# Altium schematic sheet Power_Scheme.SchDoc
size 209 x 297 mm; Author: ALTIUM GOSTBOM2.0 KEV; SheetNumber: 3; SheetTotal: 3
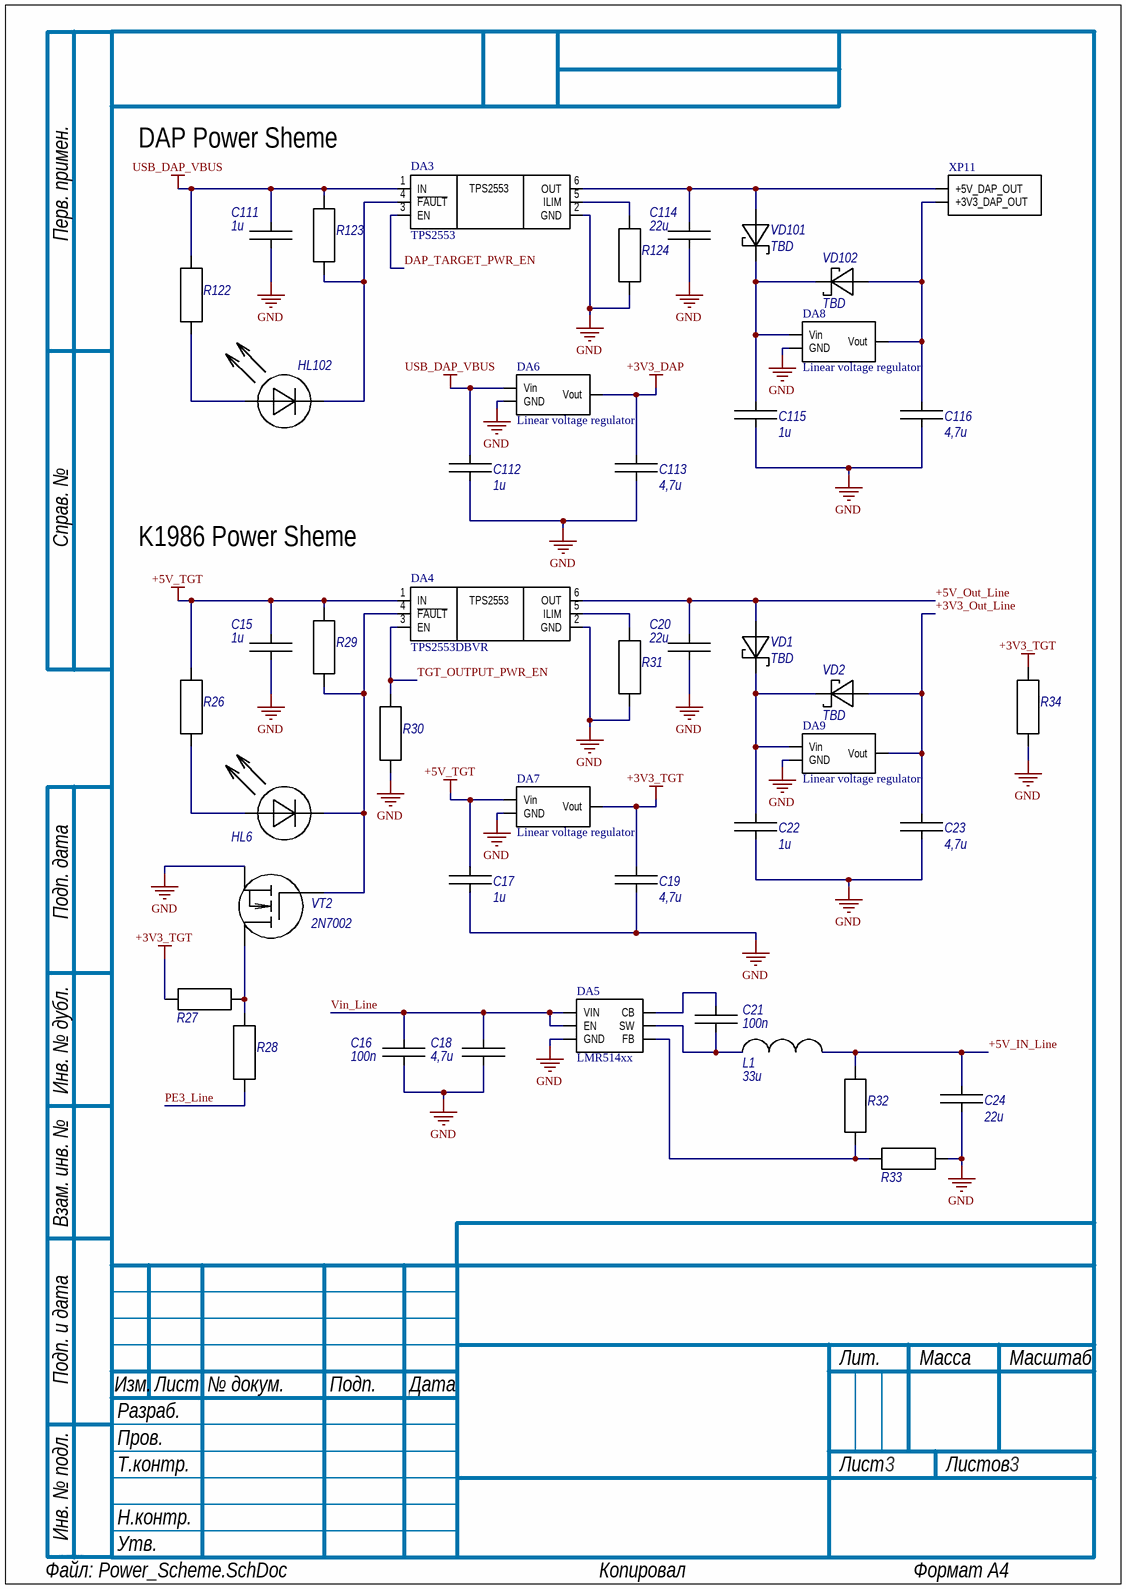
[diagram p0: Power_Scheme.SchDoc]

## Parts
C15  1u
C16  100n
C17  1u
C18  4,7u
C19  4,7u
C20  22u
C21  100n
C22  1u
C23  4,7u
C24  22u
C111  1u
C112  1u
C113  4,7u
C114  22u
C115  1u
C116  4,7u
DA3  TPS2553
DA4  TPS2553DBVR
DA5  LMR514xx
DA6  Linear voltage regulator
DA7  Linear voltage regulator
DA8  Linear voltage regulator
DA9  Linear voltage regulator
HL6  TBD  (value not drawn)
HL102  TBD  (value not drawn)
L1  33u
R26  TBD  (value not drawn)
R27  10k  (value not drawn)
R28  1k  (value not drawn)
R29  100k  (value not drawn)
R30  10k  (value not drawn)
R31  100k  (value not drawn)
R32  118k  (value not drawn)
R33  22,1k  (value not drawn)
R34  TBD  (value not drawn)
R122  TBD  (value not drawn)
R123  100k  (value not drawn)
R124  100k  (value not drawn)
VD1  TBD
VD2  TBD
VD101  TBD
VD102  TBD
VT2  2N7002
XP11  DAP_External_Power_Outputs  (value not drawn)

## Nets
+3V3_DAP: C113.1 DA6.2(Vout)
+3V3_TGT: C19.1 DA7.2(Vout) R27.2 R34.1
+5V_TGT: C15.1 C17.1 DA4.1(IN) DA7.3(Vin) R26.2 R29.1
GND: C15.2 C16.2 C17.2 C18.2 C19.2 C20.2 C22.2 C23.2 C24.2 C111.2 C112.2 C113.2 C114.2 C115.2 C116.2 DA3.2(GND) DA4.2(GND) DA5.2(GND) DA6.1(GND) DA7.1(GND) DA8.1(GND) DA9.1(GND) R30.2 R31.2 R33.1 R34.2 R124.2 VT2.S
USB_DAP_VBUS: C111.1 C112.1 DA3.1(IN) DA6.3(Vin) R122.2 R123.1
+3V3_Out_Line: C23.1 DA9.2(Vout) VD2.A
+5V_IN_Line: C24.1 L1.2 R32.1
+5V_Out_Line: C20.1 DA4.6(OUT) VD1.A
DAP_TARGET_PWR_EN: DA3.3(EN)
PE3_Line: R28.2
TGT_OUTPUT_PWR_EN: DA4.3(EN) R30.1
Vin_Line: C16.1 C18.1 DA5.4(EN) DA5.5(VIN)
NetC21_1: C21.1 DA5.1(CB)
NetC21_2: C21.2 DA5.6(SW) L1.1
NetC22_1: C22.1 DA9.3(Vin) VD1.C VD2.C
NetC114_1: C114.1 DA3.6(OUT) VD101.A XP11.2(+5V_DAP_OUT)
NetC115_1: C115.1 DA8.3(Vin) VD101.C VD102.C
NetC116_1: C116.1 DA8.2(Vout) VD102.A XP11.1(+3V3_DAP_OUT)
NetDA3_4: DA3.4(~{FAULT}) HL102.2(C) R123.2
NetDA3_5: DA3.5(ILIM) R124.1
NetDA4_4: DA4.4(~{FAULT}) HL6.2(C) R29.2 VT2.G
NetDA4_5: DA4.5(ILIM) R31.1
NetDA5_3: DA5.3(FB) R32.2 R33.2
NetHL6_1: HL6.1(A) R26.1
NetHL102_1: HL102.1(A) R122.1
NetR27_1: R27.1 R28.1 VT2.D

## Notes on the sheet
- DAP Power Sheme
- K1986 Power Sheme
- Перв. примен.
- Справ. №
- Подп. дата
- Инв. № дубл.
- Взам. инв. №
- Подп. и дата
- Изм.
- Разраб.
- Лист
- № докум.
- Подп.
- Дата
- Лит.
- Масса
- Масштаб
- Пров.
- Т.контр.
- Листов
- Инв. № подл.
- Н.контр.
- Утв.
- Файл:
- ALTIUM GOSTBOM2.0 KEV
- Копировал
- Формат А4

## Library data of the parts
C15 = Cap: Output Power TPS2553-1 input bypass capacitor from +5V_TGT, 1uF, X7R
C16 = Cap: Vin buck converter high-frequency input bypass capacitor, 100nF, 50V, X7R
C17 = Cap: +3V3_TGT LDO input bypass capacitor from +5V_TGT, 1uF, X7R
C18 = Cap: Vin synchronous buck converter input bypass capacitor, 4.7uF, 50V, X7R
C19 = Cap: +3V3_TGT LDO output capacitor, 4.7uF, X7R
C20 = Cap: +5V_Out_Line TPS2553-1 output capacitor, 22uF, X7R; effective capacitance at 5V >=10uF
C21 = Cap: LMR51410 bootstrap capacitor between CB and SW, 100nF, 16V, X7R
C22 = Cap: +3V3_Out_Line Output Power LDO input bypass capacitor after series Schottky diode, 1uF, X7R
C23 = Cap: +3V3_Out_Line Output Power LDO output capacitor, 4.7uF, X7R
C24 = Cap: +5V_IN_Line buck output capacitor, 22uF, 16V, X7R
C111 = Cap: DAP external-output TPS2553-1 input bypass capacitor, 1uF, X7R, >=10V
C112 = Cap: +3V3_DAP internal LDO input bypass capacitor, 1uF, X7R
C113 = Cap: +3V3_DAP internal LDO output capacitor, 4.7uF, X7R
C114 = Cap: +5V_DAP_OUT TPS2553-1 output capacitor, 22uF, X7R; effective capacitance at 5V >=10uF
C115 = Cap: +3V3_DAP_OUT LDO input bypass capacitor after series Schottky diode, 1uF, X7R
C116 = Cap: +3V3_DAP_OUT LDO output capacitor, 4.7uF, X7R
DA3 = TPS2553: TPS2553 current-limited switch for DAP external 5V and 3.3V outputs; active-high EN and latched fault
DA4 = TPS2553: TPS2553 current-limited switch for Output Power 5V and 3.3V outputs; source-dependent EN control deferred
DA5 = LMR514xx: LMR51410XDBVR synchronous buck converter, 8-18V Vin to 5V, 1A, 400kHz, PFM
DA6 = Linear voltage regulator: TLV76133DCYR 3.3V regulator for internal DAP supply +3V3_DAP
DA7 = Linear voltage regulator: TLV76133DCYR 3.3V regulator for K1986 target supply +3V3_TGT
DA8 = Linear voltage regulator: TLV76133DCYR 3.3V regulator for protected DAP external output +3V3_DAP_OUT
DA9 = Linear voltage regulator: TLV76133DCYR 3.3V regulator for protected +3V3_Out_Line in Output Power branch
HL6 = LED: Output Power overcurrent fault indicator LED, color and part TBD
HL102 = LED: DAP external-output overcurrent fault indicator LED, color and part TBD
L1 = Inductor: LMR51410 output inductor, 33uH, saturation current >=2.5A
R26 = res: Output Power fault LED current-limiting resistor, value TBD
R27 = res: K1986 PE3 fault-sense pull-up from 2N7002 drain to +3V3_TGT; fitted by default
R28 = res: Optional series resistor between Output Power fault-sense node and K1986 PE3; DNP by default
R29 = res: Output Power TPS2553-1 FAULT pull-up to +5V_TGT, value 100k
R30 = res: Output Power enable pull-down resistor, 10k
R31 = res: Output Power TPS2553-1 current-limit programming resistor, 100k, 1%, target total current about 300mA
R32 = res: LMR51410 feedback upper resistor from +5V_IN_Line to FB, 118k, 1%
R33 = res: LMR51410 feedback lower resistor from FB to GND, 22.1k, 1%
R34 = res: +3V3_TGT permanent discharge resistor to GND; final value TBD, initial range 4.7k to 10k
R122 = res: DAP external-output fault LED current-limiting resistor, value TBD
R123 = res: DAP external-output TPS2553-1 FAULT pull-up to USB_DAP_VBUS, value 100k
R124 = res: DAP external-output TPS2553-1 current-limit programming resistor, 100k, 1%, target total current about 300mA
VD1 = Schottky: Output Power 3.3V LDO series input Schottky diode, part TBD
VD2 = Schottky: Output Power 3.3V LDO output-to-input reverse-current protection Schottky diode, part TBD
VD101 = Schottky: DAP external-output 3.3V LDO series input Schottky diode, part TBD
VD102 = Schottky: DAP external-output 3.3V LDO output-to-input reverse-current protection Schottky diode, part TBD
VT2 = TRANS-N-FET: Output Power TPS2553-1 FAULT level shifter for K1986 PE3; active-high fault indication
XP11 = DAP_External_Power_Outputs: DAP external target power-output interface for +5V_DAP_OUT, +3V3_DAP_OUT and GND